# Altium schematic sheet Sheet2.SchDoc
size B
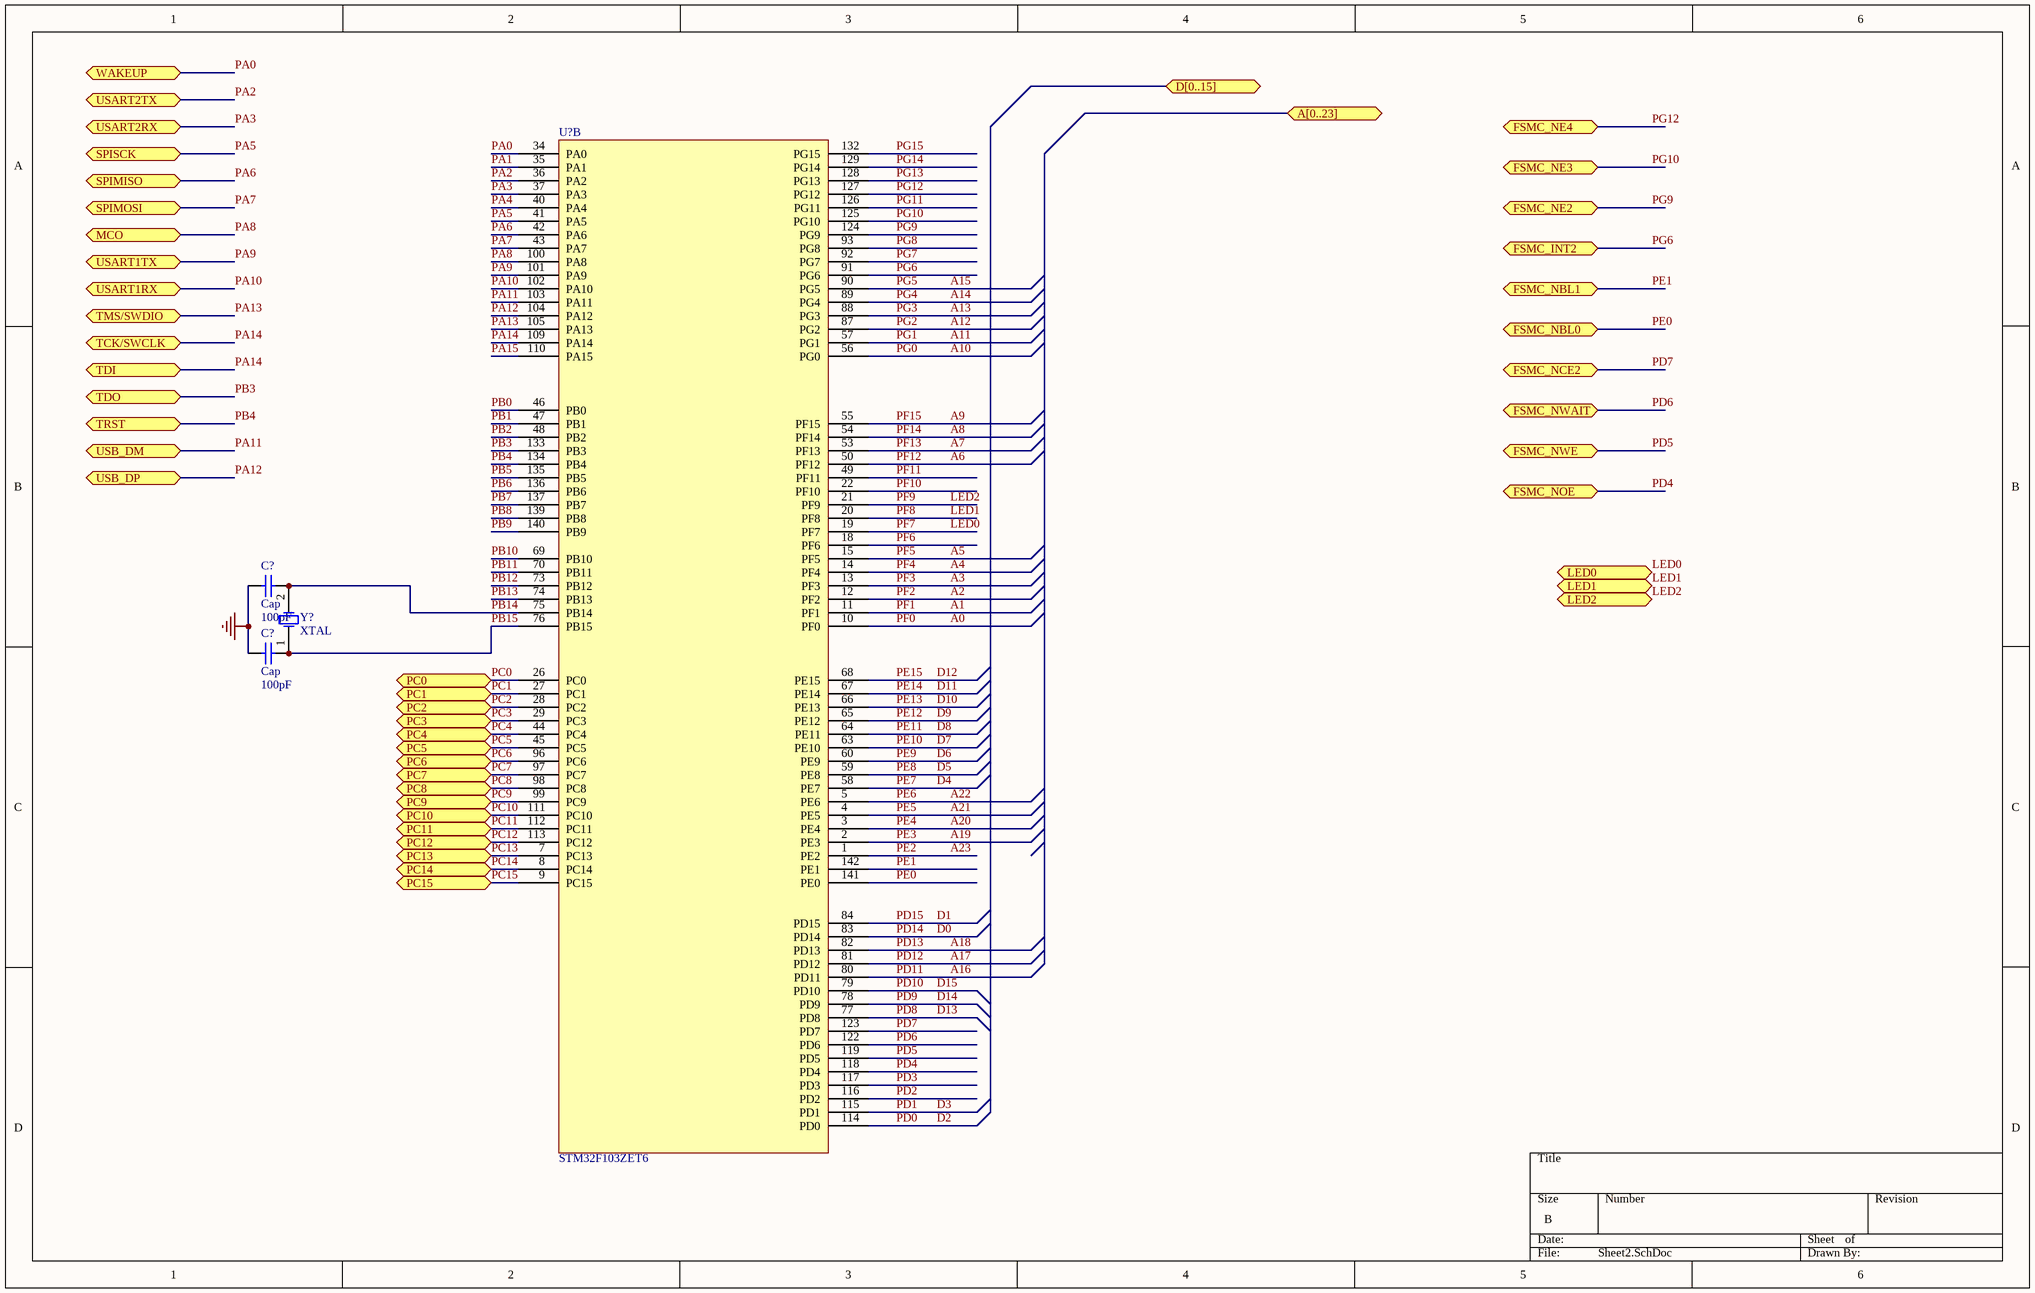
[diagram p0: Sheet2.SchDoc]

## Parts
(Parts that share a designator on the sheet are numbered #1, #2 ... from top to bottom, then left to right.)
C?#1  Cap  value 100pF  [RAD-0.3]
C?#2  Cap  value 100pF  [RAD-0.3]
U?  STM32F103ZET6  (part B of 3)
Y?  XTAL  [R38]

## Ports
A[0..23] (bidir), D[0..15] (bidir), FSMC_INT2 (bidir), FSMC_NBL0 (bidir), FSMC_NBL1 (bidir), FSMC_NCE2 (bidir), FSMC_NE2 (bidir), FSMC_NE3 (bidir), FSMC_NE4 (bidir), FSMC_NOE (bidir), FSMC_NWAIT (bidir), FSMC_NWE (bidir), LED0 (bidir), LED1 (bidir), LED2 (bidir), MCO (bidir), PC0 (bidir), PC1 (bidir), PC2 (bidir), PC3 (bidir), PC4 (bidir), PC5 (bidir), PC6 (bidir), PC7 (bidir), PC8 (bidir), PC9 (bidir), PC10 (bidir), PC11 (bidir), PC12 (bidir), PC13 (bidir), PC14 (bidir), PC15 (bidir), SPIMISO (bidir), SPIMOSI (bidir), SPISCK (bidir), TCK/SWCLK (bidir), TDI (bidir), TDO (bidir), TMS/SWDIO (bidir), TRST (bidir), USART1RX (bidir), USART1TX (bidir), USART2RX (bidir), USART2TX (bidir), USB_DM (bidir), USB_DP (bidir), WAKEUP (bidir)

## Nets
GND: C?#1.1 C?#2.1
A0: U?.10(PF0)  [also labelled PF0]
A1: U?.11(PF1)  [also labelled PF1]
A2: U?.12(PF2)  [also labelled PF2]
A3: U?.13(PF3)  [also labelled PF3]
A4: U?.14(PF4)  [also labelled PF4]
A5: U?.15(PF5)  [also labelled PF5]
A6: U?.50(PF12)  [also labelled PF12]
A7: U?.53(PF13)  [also labelled PF13]
A8: U?.54(PF14)  [also labelled PF14]
A9: U?.55(PF15)  [also labelled PF15]
A10: U?.56(PG0)  [also labelled PG0]
A11: U?.57(PG1)  [also labelled PG1]
A12: U?.87(PG2)  [also labelled PG2]
A13: U?.88(PG3)  [also labelled PG3]
A14: U?.89(PG4)  [also labelled PG4]
A15: U?.90(PG5)  [also labelled PG5]
A16: U?.80(PD11)  [also labelled PD11]
A17: U?.81(PD12)  [also labelled PD12]
A18: U?.82(PD13)  [also labelled PD13]
A19: U?.2(PE3)  [also labelled PE3]
A20: U?.3(PE4)  [also labelled PE4]
A21: U?.4(PE5)  [also labelled PE5]
A22: U?.5(PE6)  [also labelled PE6]
A23: U?.1(PE2)  [also labelled PE2]
D0: U?.83(PD14)  [also labelled PD14]
D1: U?.84(PD15)  [also labelled PD15]
D2: U?.114(PD0)  [also labelled PD0]
D3: U?.115(PD1)  [also labelled PD1]
D4: U?.58(PE7)  [also labelled PE7]
D5: U?.59(PE8)  [also labelled PE8]
D6: U?.60(PE9)  [also labelled PE9]
D7: U?.63(PE10)  [also labelled PE10]
D8: U?.64(PE11)  [also labelled PE11]
D9: U?.65(PE12)  [also labelled PE12]
D10: U?.66(PE13)  [also labelled PE13]
D11: U?.67(PE14)  [also labelled PE14]
D12: U?.68(PE15)  [also labelled PE15]
D13: U?.77(PD8)  [also labelled PD8]
D14: U?.78(PD9)  [also labelled PD9]
D15: U?.79(PD10)  [also labelled PD10]
LED0: U?.19(PF7) ; port LED0  [also labelled PF7]
LED1: U?.20(PF8) ; port LED1  [also labelled PF8]
LED2: U?.21(PF9) ; port LED2  [also labelled PF9]
PA0: U?.34(PA0) ; port WAKEUP
PA1: U?.35(PA1)
PA2: U?.36(PA2) ; port USART2TX
PA3: U?.37(PA3) ; port USART2RX
PA4: U?.40(PA4)
PA5: U?.41(PA5) ; port SPISCK
PA6: U?.42(PA6) ; port SPIMISO
PA7: U?.43(PA7) ; port SPIMOSI
PA8: U?.100(PA8) ; port MCO
PA9: U?.101(PA9) ; port USART1TX
PA10: U?.102(PA10) ; port USART1RX
PA11: U?.103(PA11) ; port USB_DM
PA12: U?.104(PA12) ; port USB_DP
PA13: U?.105(PA13) ; port TMS/SWDIO
PA14: U?.109(PA14) ; port TCK/SWCLK, port TDI
PA15: U?.110(PA15)
PB0: U?.46(PB0)
PB1: U?.47(PB1)
PB2: U?.48(PB2)
PB3: U?.133(PB3) ; port TDO
PB4: U?.134(PB4) ; port TRST
PB5: U?.135(PB5)
PB6: U?.136(PB6)
PB7: U?.137(PB7)
PB8: U?.139(PB8)
PB9: U?.140(PB9)
PB10: U?.69(PB10)
PB11: U?.70(PB11)
PB12: U?.73(PB12)
PB13: U?.74(PB13)
PB14: C?#1.2 U?.75(PB14) Y?.2(OSC2)
PB15: C?#2.2 U?.76(PB15) Y?.1(OSC1)
PC0: U?.26(PC0) ; port PC0
PC1: U?.27(PC1) ; port PC1
PC2: U?.28(PC2) ; port PC2
PC3: U?.29(PC3) ; port PC3
PC4: U?.44(PC4) ; port PC4
PC5: U?.45(PC5) ; port PC5
PC6: U?.96(PC6) ; port PC6
PC7: U?.97(PC7) ; port PC7
PC8: U?.98(PC8) ; port PC8
PC9: U?.99(PC9) ; port PC9
PC10: U?.111(PC10) ; port PC10
PC11: U?.112(PC11) ; port PC11
PC12: U?.113(PC12) ; port PC12
PC13: U?.7(PC13) ; port PC13
PC14: U?.8(PC14) ; port PC14
PC15: U?.9(PC15) ; port PC15
PD2: U?.116(PD2)
PD3: U?.117(PD3)
PD4: U?.118(PD4) ; port FSMC_NOE
PD5: U?.119(PD5) ; port FSMC_NWE
PD6: U?.122(PD6) ; port FSMC_NWAIT
PD7: U?.123(PD7) ; port FSMC_NCE2
PE0: U?.141(PE0) ; port FSMC_NBL0
PE1: U?.142(PE1) ; port FSMC_NBL1
PF6: U?.18(PF6)
PF10: U?.22(PF10)
PF11: U?.49(PF11)
PG6: U?.91(PG6) ; port FSMC_INT2
PG7: U?.92(PG7)
PG8: U?.93(PG8)
PG9: U?.124(PG9) ; port FSMC_NE2
PG10: U?.125(PG10) ; port FSMC_NE3
PG11: U?.126(PG11)
PG12: U?.127(PG12) ; port FSMC_NE4
PG13: U?.128(PG13)
PG14: U?.129(PG14)
PG15: U?.132(PG15)

## Library data of the parts
C?#1 C?#2 = Cap: Capacitor; Published: 8-Jun-2000; LatestRevisionDate: 17-Jul-2002; LatestRevisionNote: Re-released for DXP Platform.; PackageReference: RAD-0.3; Publisher: Altium Limited
Y? = XTAL: Crystal Oscillator; Published: 8-Jun-2000; LatestRevisionDate: 17-Jul-2002; LatestRevisionNote: Re-released for DXP Platform.; PackageReference: R38; Publisher: Altium Limited